# EAGLE design ubiquitel (EAGLE 8.2.2)
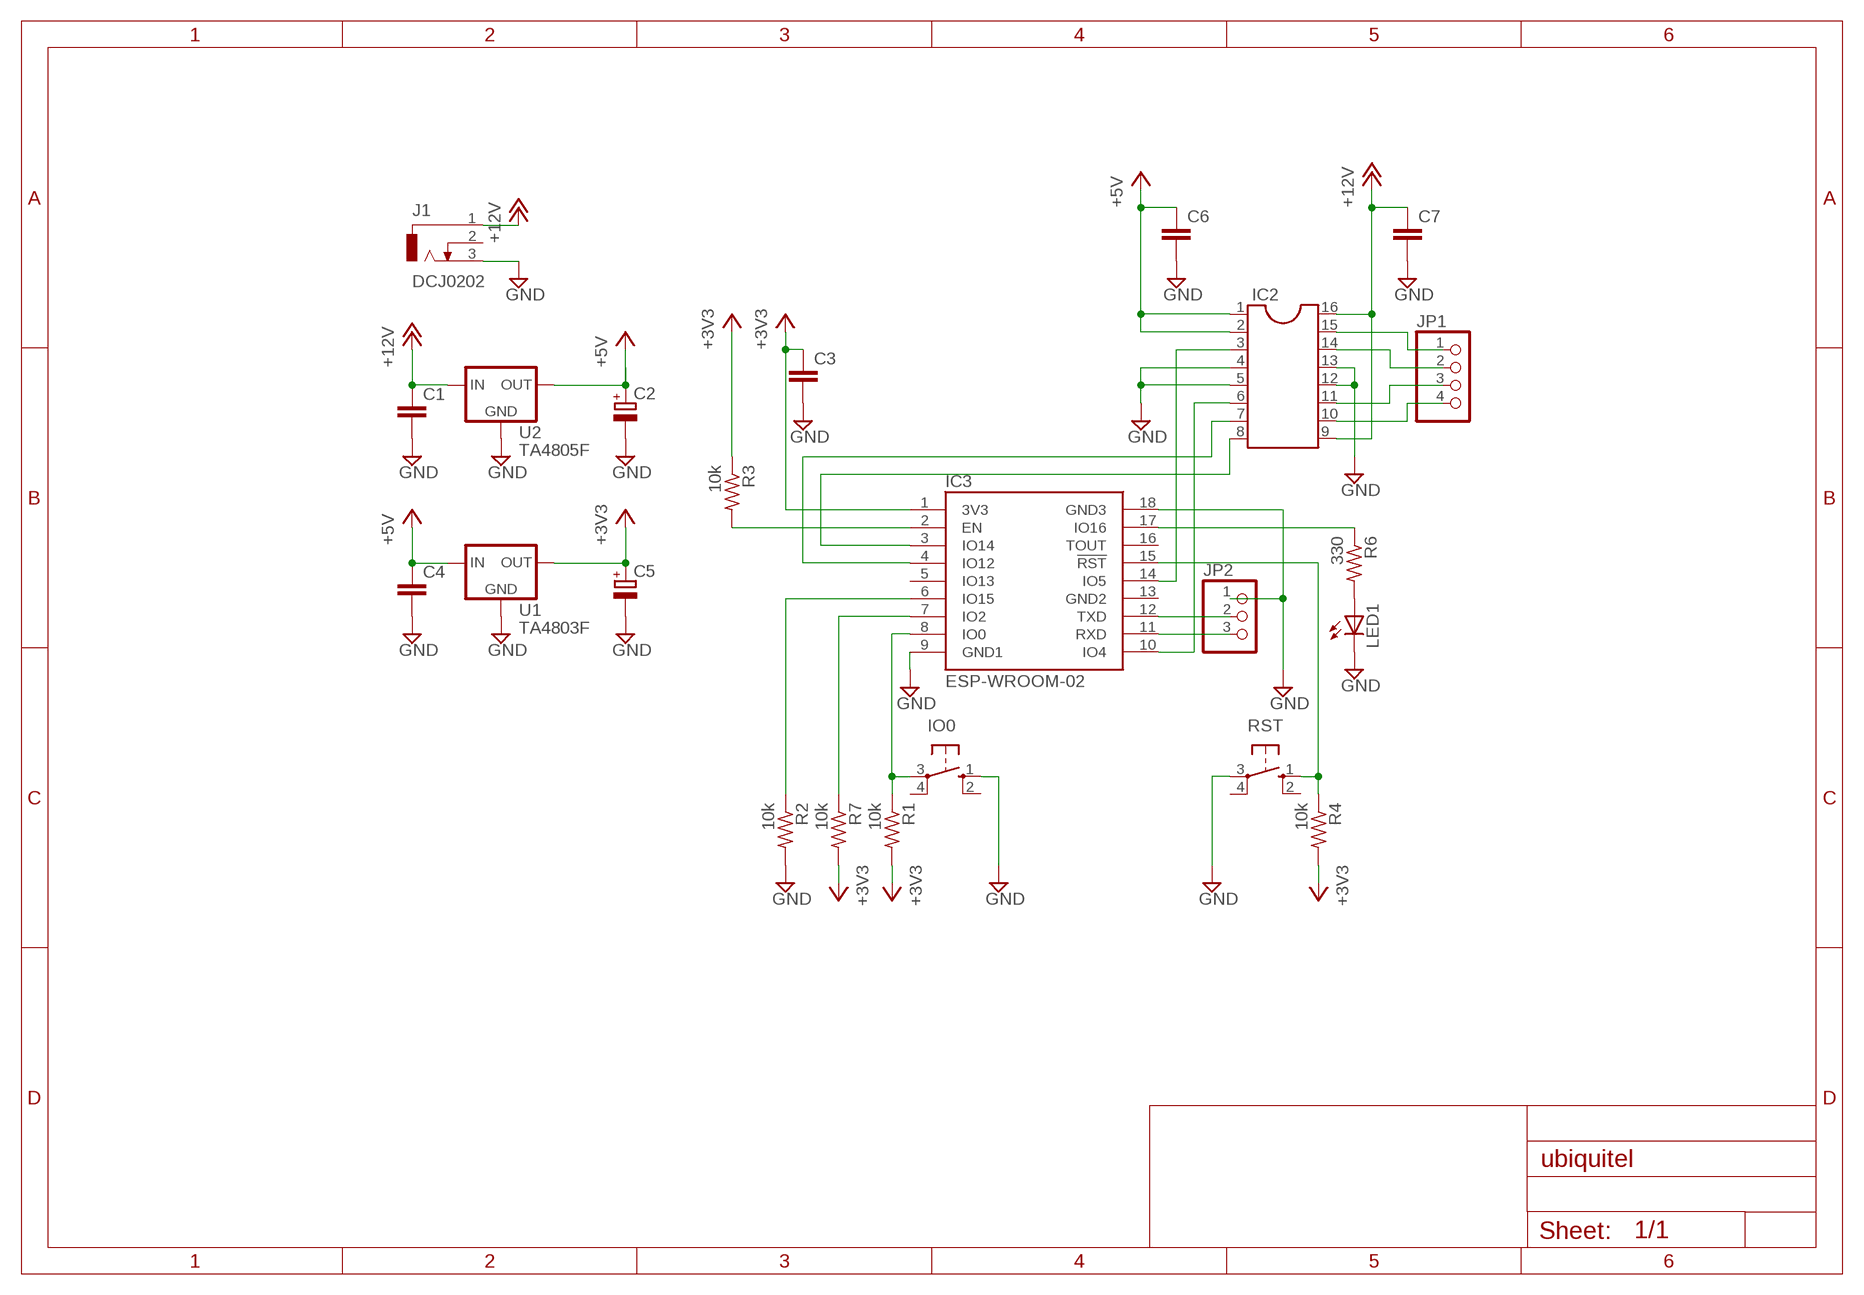
[diagram p0: schematic, sheet 1]

## Parts
C1  C-EU025-024X044  [C025-024X044]
C2  CPOL-EUE2-5  [E2-5]
C3  C-EU025-024X044  [C025-024X044]
C4  C-EU025-024X044  [C025-024X044]
C5  CPOL-EUE2-5  [E2-5]
C6  C-EU025-024X044  [C025-024X044]
C7  C-EU025-024X044  [C025-024X044]
IC2  DIL16S  [SOCKET-16]
IC3  ESP-WROOM-02  [WROOM-02]
IO0  10-XX(タクトスイッチ)  [B3F-10XX]
J1  DCJ0202  [DCJ0202]
JP1  PINHD-1X4  [1X04]
JP2  PINHD-1X3  [1X03]
LED1  LED3MM  [LED3MM]
R1  10k  R-US_0207/10  [0207/10]
R2  10k  R-US_0207/10  [0207/10]
R3  10k  R-US_0207/10  [0207/10]
R4  10k  R-US_0207/10  [0207/10]
R6  330  R-US_0207/10  [0207/10]
R7  10k  R-US_0207/10  [0207/10]
RST  10-XX(タクトスイッチ)  [B3F-10XX]
U1  TA4803F  [CUSTOM]
U2  TA4805F  [CUSTOM]

## Nets
+3V3: C3.1 C5.+ IC3.1(3V3) R1.2 R3.1 R4.2 R7.2 U1.P$3(OUT)
+5V: C2.+ C4.1 C6.1 IC2.1 IC2.2 U1.P$1(IN) U2.P$3(OUT)
+12V [power]: C1.1 C7.1 IC2.9 IC2.16 J1.1 U2.P$1(IN)
GND [power]: C1.2 C2.- C3.2 C4.2 C5.- C6.2 C7.2 IC2.4 IC2.5 IC2.12 IC2.13 IC3.9(GND1) IC3.18(GND3) IO0.1(S) J1.3 JP2.1 LED1.K(C) R2.2 RST.3(P) U1.P$2(GND) U2.P$2(GND)
N$1: IC3.6(IO15) R2.1
N$2: IC3.2(EN) R3.2
N$3: IC3.11(RXD) JP2.3
N$4: IC3.15(!RST!) R4.1 RST.1(S)
N$5: IC3.7(IO2) R7.1
N$6: IC2.3 IC3.14(IO5)
N$7: IC2.6 IC3.10(IO4)
N$8: IC2.7 IC3.4(IO12)
N$9: IC2.8 IC3.3(IO14)
N$10: IC3.8(IO0) IO0.3(P) R1.1
N$11: LED1.A R6.2
N$12: IC3.17(IO16) R6.1
N$13: IC3.12(TXD) JP2.2
N$14 [power]: IC2.10 JP1.4
N$15 [power]: IC2.11 JP1.3
N$16 [power]: IC2.14 JP1.2
N$17 [power]: IC2.15 JP1.1
Unconnected: IC3.5(IO13) IC3.13(GND2) IC3.16(TOUT) IO0.2(S1) IO0.4(P1) J1.2 RST.2(S1) RST.4(P1)

## Library data of the parts
C1 C3 C4 C6 C7 = rcl:C-EU: CAPACITOR, European symbol
C2 C5 = rcl:CPOL-EU: POLARIZED CAPACITOR, European symbol
IC2 = ic-package:DIL16: Dual In Line / Socket
IC3 = sensor:ESP-WROOM-02: ESP8266 WROOM-02
IO0 RST = MyLibraries:10-XX(タクトスイッチ): OMRON SWITCH 秋月電子 <http://akizukidenshi.com/catalog/g/gP-03648/>; MPN: B3F-1000; OC_FARNELL: 176432; OC_NEWARK: 36M3542
J1 = con-jack:DCJ0202: DC POWER JACK Source: DCJ0202.pdf; OC_FARNELL: unknown; OC_NEWARK: unknown
JP1 = pinhead:PINHD-1X4: PIN HEADER
JP2 = pinhead:PINHD-1X3: PIN HEADER
LED1 = BS21Lab-LEDs:LED: LED
R1-R4 R6 R7 = rcl:R-US_: RESISTOR, American symbol
U1 U2 = BS21Lab-Regulators:TA48?*: TA48 series

## Net classes
0 default: width 0.152 mm
1 power: width 0.61 mm

## Board
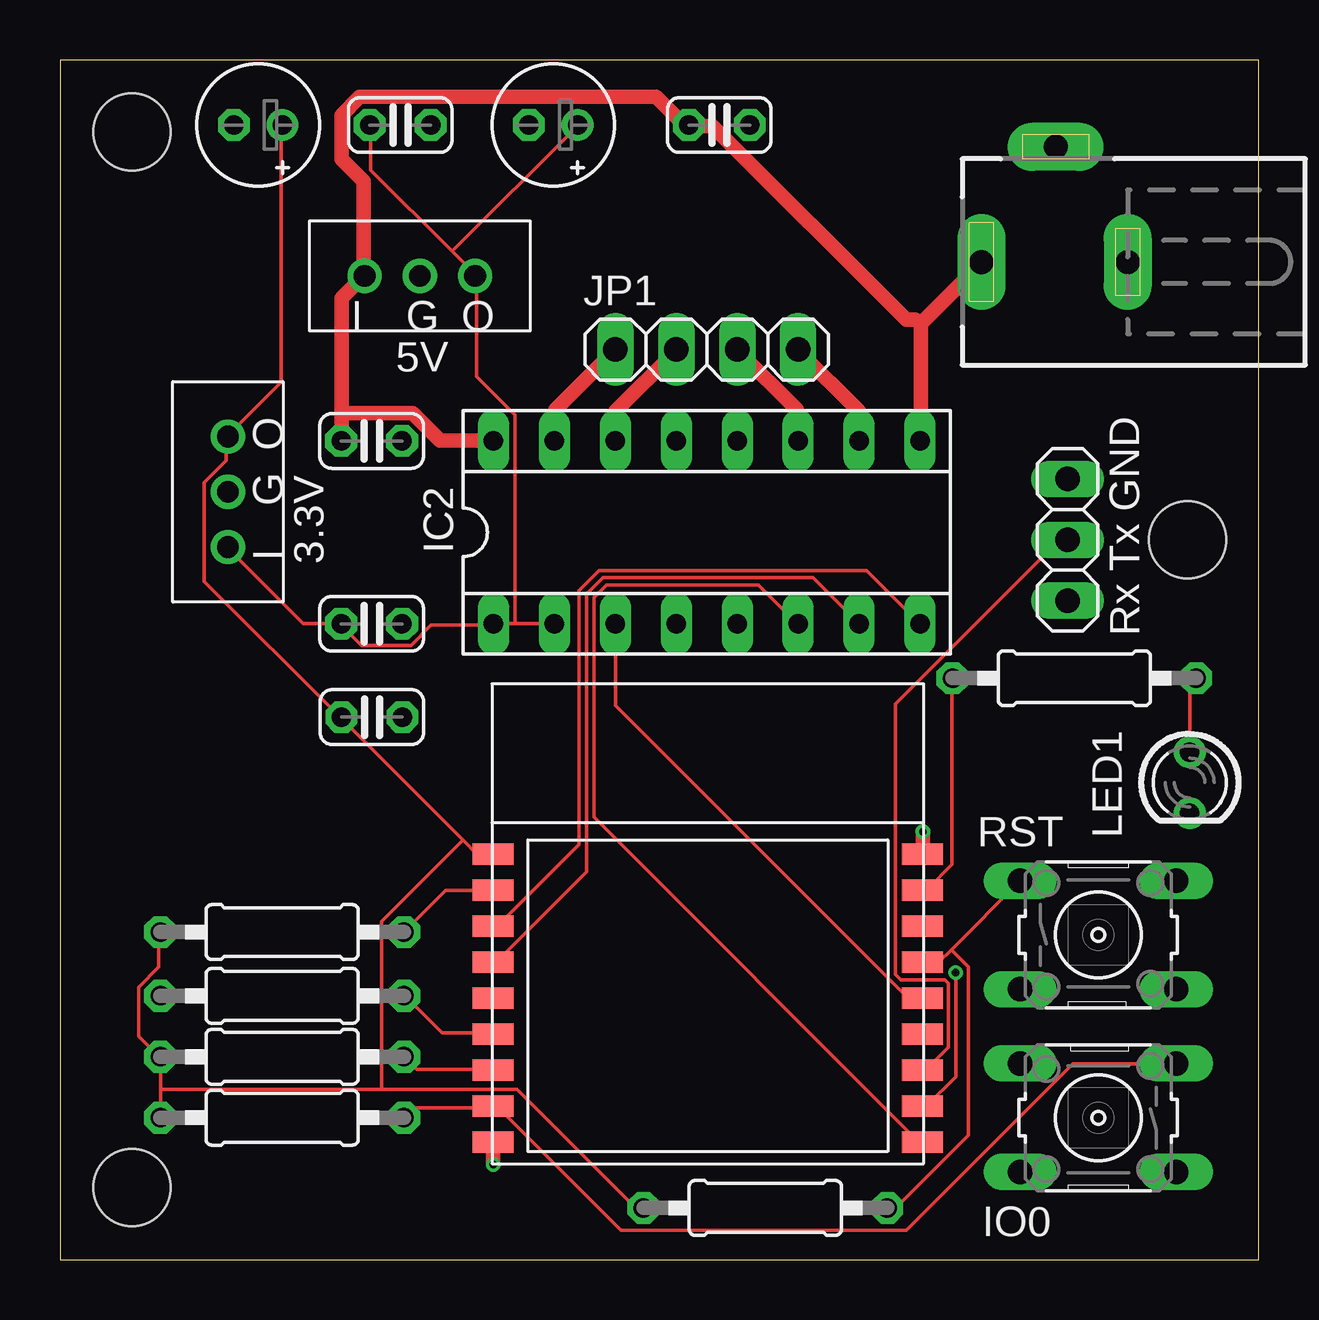
[diagram p1: board, top side]
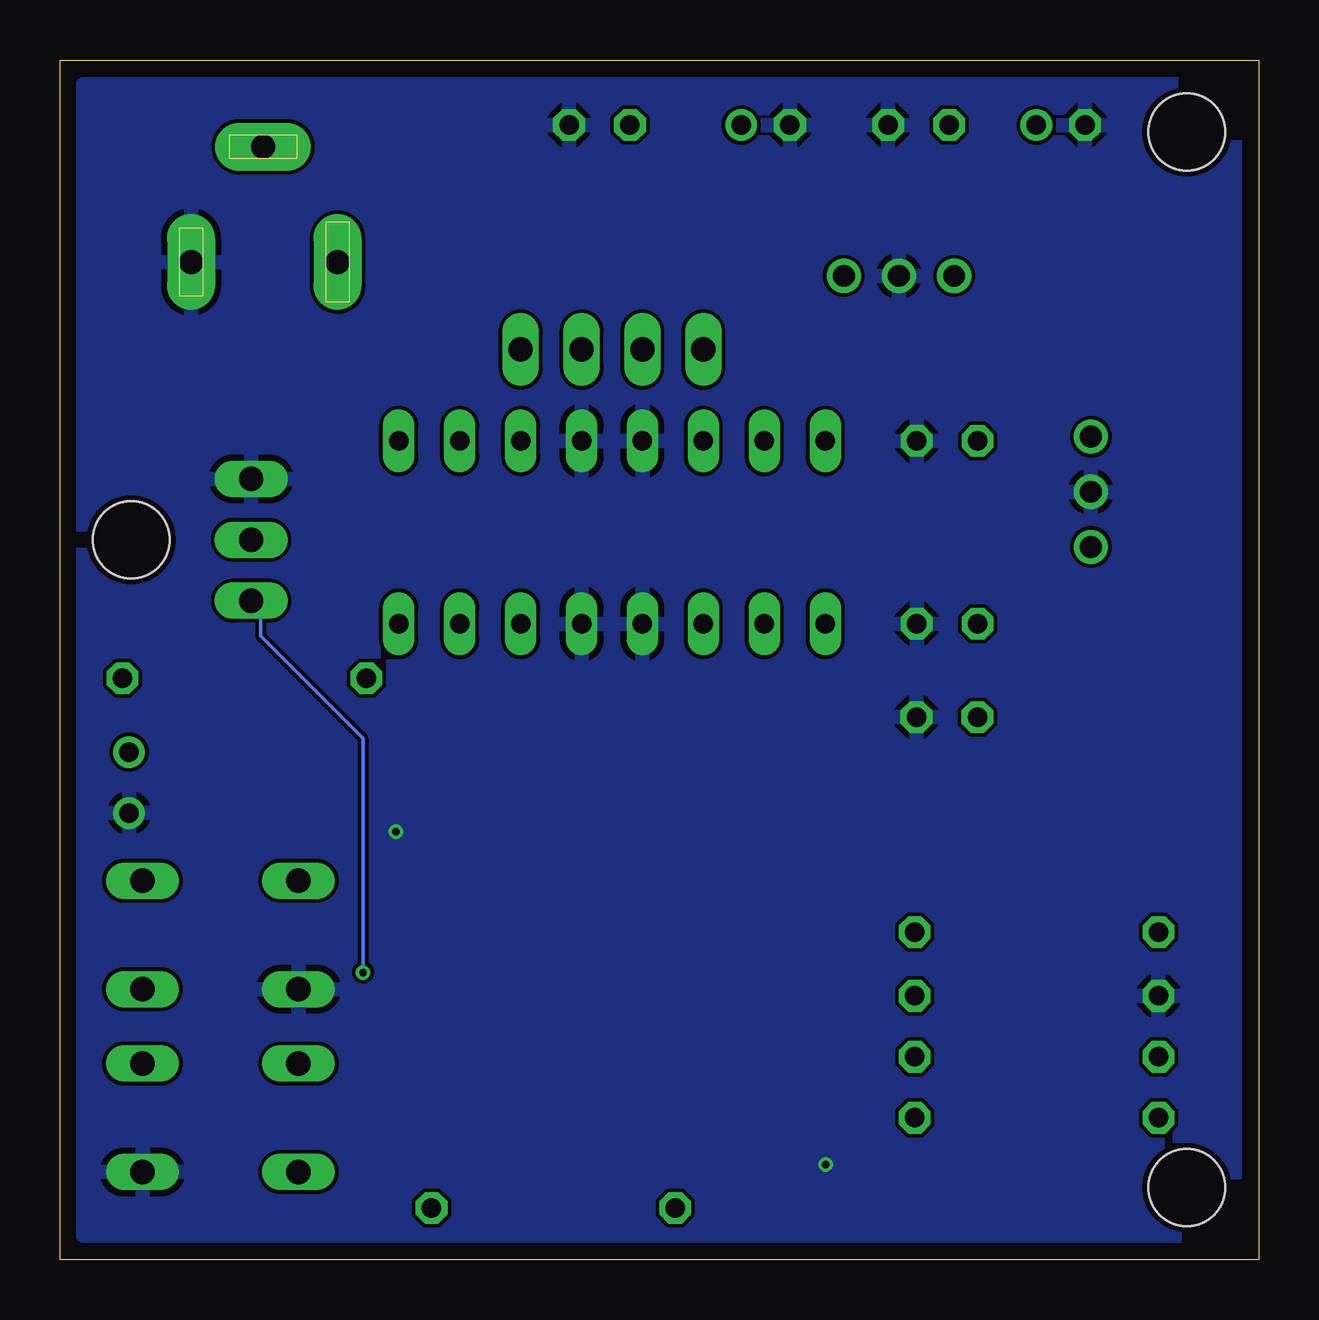
[diagram p2: board, bottom side, seen from below]

Size 49.97 x 50 mm. Coordinates in mm from the lower left corner, seen from the top.
Outline: 0,0 49.97,0 49.97,50 0,50 0,0
Copper layers (1*16): Top 0.035mm / dielectric 1.5mm / Bottom 0.035mm
Design rules "ssci_SeeedStudio_2layer_DRU_no_angle": minimum track width 6mil, minimum drill 12mil, track to track 6mil, track to pad 6mil, pad to pad 6mil, via to via 6mil, smd to smd 0mil, copper to edge 10mil, drill to drill 10mil, minimum pad ring 10mil, minimum via ring 6mil, stop-mask expansion 2mil, vias tented up to drill 25mil, thermal gap 10mil
Holes 3.2 mm at 3,3 3,47 47,30

### Footprints (pad centres in the part's own frame; a part is rotated, then mirrored left to right if it is on the bottom)
C025-024X044 = drill 0.813 octagon: 1 -1.27,0; 2 1.27,0
E2-5 = drill 0.813 pad 1.27: + -1.016,0 | drill 0.813 pad 1.27 octagon: - 1.016,0
SOCKET-16 = drill 0.813 long: 1 -8.89,-3.81; 2 -6.35,-3.81; 3 -3.81,-3.81; 4 -1.27,-3.81; 5 1.27,-3.81; 6 3.81,-3.81; 7 6.35,-3.81; 8 8.89,-3.81; 9 8.89,3.81; 10 6.35,3.81; 11 3.81,3.81; 12 1.27,3.81; 13 -1.27,3.81; 14 -3.81,3.81; 15 -6.35,3.81; 16 -8.89,3.81
WROOM-02 = smd 1.7 x 0.9: 1 -8.95,2.9; 2 -8.95,1.4; 3 -8.95,-0.1; 4 -8.95,-1.6; 5 -8.95,-3.1; 6 -8.95,-4.6; 7 -8.95,-6.1; 8 -8.95,-7.6; 9 -8.95,-9.1; 10 8.95,-9.1; 11 8.95,-7.6; 12 8.95,-6.1; 13 8.95,-4.6; 14 8.95,-3.1; 15 8.95,-1.6; 16 8.95,-0.1; 17 8.95,1.4; 18 8.95,2.9
B3F-10XX = drill 1.016 long: 1 -3.251,2.261; 2 3.251,2.261; 3 -3.251,-2.261; 4 3.251,-2.261
DCJ0202 = drill 1 pad 2 long: 1 0,3.1; 2 4.8,0; 3 0,-3
1X04 = drill 1.016 long: 1 -3.81,0; 2 -1.27,0; 3 1.27,0; 4 3.81,0
1X03 = drill 1.016 long: 1 -2.54,0; 2 0,0; 3 2.54,0
LED3MM = drill 0.813: A -1.27,0; K 1.27,0
0207/10 = drill 0.813 octagon: 1 -5.08,0; 2 5.08,0
CUSTOM = drill 0.914: P$1 -2.3,0; P$2 0,0; P$3 2.3,0

### Placement (x,y rotation side)
C1  27.48,47.29 0 top
C2  20.56,47.29 180 top
C3  13,22.61 0 top
C4  14.18,47.29 0 top
C5  8.26,47.29 180 top
C6  12.99,26.5 0 top
C7  12.99,34.12 0 top
IC2  26.96,30.31 0 top
IC3  27,14 0 top
IO0  43.28,5.91 180 top
J1  41.51,41.58 90 top
JP1  26.96,37.93 0 top
JP2  42,30 270 top
LED1  47.09,19.88 270 top
R1  9.26,5.91 180 top
R2  9.26,10.99 180 top
R3  9.26,13.65 0 top
R4  29.4,2.15 180 top
R6  42.28,24.23 0 top
R7  9.26,8.45 180 top
RST  43.28,13.53 0 top
U1  7,32 90 top
U2  15,41 0 top

### Tracks (layer width: path | path; a pad name or v marks a point on that pad's centre or on a via)
+3V3
  Top 0.152: C5.+ 9.22,47.24 9.22,36.58 7.01,34.37 U1.P$3 6.93,34.29 6.93,33.3 6.02,32.38 6.02,28.27 11.66,22.63 C3.1 11.73,22.55 16.8,17.49 | 16.8,17.49 17.37,16.92 17.98,16.92 IC3.1 | 4.19,7.09 4.19,8.38 R7.2 4.12,8.46 3.28,9.3 3.28,11.35 4.12,12.19 4.12,13.64 R3.1 | 4.19,7.09 4.19,5.94 R1.2 | 4.19,7.09 13.41,7.09 | 13.41,7.09 19.05,7.09 23.93,2.21 24.31,2.21 R4.2 | 16.8,17.49 13.41,14.1 13.41,7.09
+5V
  Top 0.152: 16.34,42.02 17.3,41.07 U2.P$3 17.37,41 17.37,36.8 18.97,35.2 18.97,26.52 | 16.34,42.02 12.95,45.41 12.95,47.24 C4.1 | 16.34,42.02 21.57,47.24 C2.+ | 18.97,26.52 20.57,26.52 IC2.2 | 18.97,26.52 18.14,26.52 IC2.1 18.06,26.44 15.47,26.44 14.63,25.6 12.57,25.6 11.73,26.44 C6.1 11.66,26.52 10.13,26.52 7.01,29.64 U1.P$1
+12V
  Top 0.61: 11.73,35.28 11.73,40.08 12.65,41 U2.P$1 12.65,41.3 12.65,44.96 11.73,45.87 11.73,47.7 12.5,48.46 24.84,48.46 25.91,47.4 C1.1 26.21,47.24 27.2,47.24 35.28,39.17 35.66,39.17 35.89,39.01 | 11.73,35.28 11.73,34.14 C7.1 | 11.73,35.28 14.71,35.28 15.85,34.14 18.06,34.14 IC2.16 | 35.89,39.01 35.89,34.14 IC2.9 | 35.89,39.01 38.41,41.53 J1.1
GND  (via drill 0.3)
  Top 0.61: v18.06,3.96 18.06,4.88 IC3.9 | v35.97,17.83 35.97,16.92 IC3.18
  pour Bottom: 1,49 49,49 49,1 1,1
N$1
  Top 0.152: IC3.6 17.98,9.45 15.93,9.45 14.4,10.97 R2.1
N$2
  Top 0.152: IC3.2 17.98,15.39 16.08,15.39 14.4,13.72 R3.2
N$3  (via drill 0.3)
  Top 0.152: v37.34,11.96 37.34,7.62 36.12,6.4 35.97,6.4 IC3.11
  Bottom 0.152: v37.34,11.96 37.34,21.72 41.6,25.98 41.6,27.05 41.99,27.43 JP2.3
N$4
  Top 0.152: 37.15,12.92 40.01,15.77 RST.1 | 37.15,12.92 36.65,12.42 35.97,12.42 IC3.15 | 37.15,12.92 37.87,12.19 37.87,5.18 34.9,2.21 34.52,2.21 R4.1
N$5
  Top 0.152: IC3.7 17.98,7.92 14.86,7.92 14.4,8.38 R7.1
N$6
  Top 0.152: IC3.14 35.89,10.97 35.28,10.97 23.16,23.09 23.16,26.44 IC2.3
N$7
  Top 0.152: IC3.10 35.89,4.95 35.74,4.95 22.25,18.44 22.25,27.58 22.78,28.12 29.11,28.12 30.71,26.52 IC2.6
N$8
  Top 0.152: IC3.4 18.06,12.42 18.21,12.42 21.95,16.15 21.95,27.74 22.63,28.42 31.39,28.42 33.3,26.52 IC2.7
N$9
  Top 0.152: IC3.3 18.06,13.95 18.29,13.95 21.64,17.3 21.64,27.89 22.48,28.73 33.6,28.73 35.81,26.52 IC2.8
N$10
  Top 0.152: R1.1 14.4,5.94 14.78,6.33 17.98,6.33 IC3.8 18.06,6.33 18.29,6.33 23.39,1.22 35.28,1.22 42.22,8.15 46.48,8.15 IO0.3
N$11
  Top 0.152: LED1.A 47.09,21.18 47.09,23.93 47.32,24.16 R6.2
N$12
  Top 0.152: IC3.17 35.97,15.47 36.2,15.47 37.19,16.46 37.19,24.16 R6.1
N$13
  Top 0.152: IC3.12 35.97,7.92 36.12,7.92 37.03,8.84 37.03,11.51 36.88,11.66 35.05,11.66 34.82,11.89 34.82,23.16 41.6,29.95 41.99,29.95 JP2.2
N$14
  Top 0.61: IC2.10 33.3,34.14 33.3,35.36 30.79,37.87 JP1.4
N$15
  Top 0.61: IC2.11 30.71,34.14 30.71,35.43 28.27,37.87 JP1.3
N$16
  Top 0.61: IC2.14 23.16,34.14 23.16,35.36 25.68,37.87 JP1.2
N$17
  Top 0.61: IC2.15 20.65,34.14 20.65,35.43 23.09,37.87 JP1.1

### Text on the board
tPlace: 5V | 3.3V | Rx Tx GND